# Altium schematic sheet protecao.SchDoc
size A4
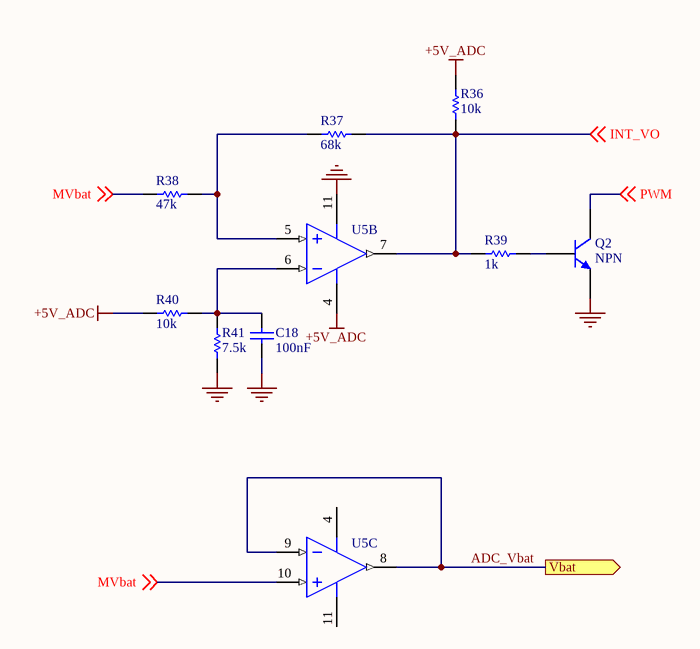
[diagram p0: protecao.SchDoc]

## Parts
C18  100nF  [6-0805_M]
Q2  NPN  [TO-226-AA]
R36  10k  [6-0805_M]
R37  68k  [6-0805_M]
R38  47k  [6-0805_M]
R39  1k  [6-0805_M]
R40  10k  [6-0805_M]
R41  7.5k  [6-0805_M]
U5  LP324M  [M14A_M]  (value not drawn)  (parts B,C of 4)

## Ports
Vbat (out)

## Nets
+5V_ADC: R36.1 R40.1 U5.4(V+)
GND: C18.1 Q2.3(E) R41.1 U5.11(GND)
ADC_Vbat: U5.8(OUT3) U5.9(IN3-) ; port Vbat
INT_VO: R36.2 R37.2 R39.1 U5.7(OUT2) ; off-sheet INT_VO
MVbat: R38.1 U5.10(IN3+) ; off-sheet MVbat
PWM: Q2.1(C) ; off-sheet PWM
NetC18_2: C18.2 R40.2 R41.2 U5.6(IN2-)
NetQ2_2: Q2.2(B) R39.2
NetR37_1: R37.1 R38.2 U5.5(IN2+)

## Library data of the parts
C18 = Cap_3: Capacitor; Published: 8-Jun-2000; LatestRevisionDate: 17-Jul-2002; LatestRevisionNote: Re-released for DXP Platform.; PackageReference: RAD-0.3; Publisher: Altium Limited; PackageDescription: Radial Cap, Thru-Hole; 2 Leads; 0.3 in Pin Spacing; Value: 100nF
Q2 = NPN: NPN Bipolar Transistor; Published: 8-Jun-2000; LatestRevisionDate: 17-Jul-2002; LatestRevisionNote: Re-released for DXP Platform.; PackageReference: TO-226-AA; Publisher: Altium Limited; PackageDescription: TO, Flat Index; 3 In-Line, Axial Leads; Body Dia. 4.8mm; Leads 0.55 x 0.51 mm (max); Code_JEDEC: TO-226-AA
R36-R41 = Res1: Resistor; Published: 8-Jun-2000; LatestRevisionDate: 17-Jul-2002; LatestRevisionNote: Re-released for DXP Platform.; PackageReference: AXIAL-0.3; Publisher: Altium Limited; PackageDescription: Axial Device, Thru-Hole; 2 Leads; 0.3 in Pin Spacing
  R36 R40: Value: 10k
  R37: Value: 68k
  R38: Value: 47k
  R39: Value: 1k
  R41: Value: 7.5k
U5 = LP324M: Micropower Quad Operational Amplifier; Manufacturer: National Semiconductor; CompType: Amplifiers; PackageTopMarking: NSUZXYTT*LP324M; PowerWise: N; Published: 4-Dec-2008; DatasheetVersion: Jul-2001; PackageVersion: revJ, Jan-1996; PackageReference: M14A; Publisher: Altium Limited; PackageDescription: Molded Package S.O., .150in Wide, 14 Lead; PartNumber: LP324M; RoHS: O; PinCount: 14; DigiKeyPartNumber: LP324MXCT-ND; Code_JEDEC: MS-012AB; Code_IPC: SOIC127P600-14; ComponentLink1Description: LP324 Datasheet; ComponentLink1URL: http://www.national.com/ds/LP/LP324.pdf; ComponentLink2Description: LP324 Web Page; ComponentLink2URL: http://www.national.com/pf/LP/LP324.html; ComponentLink3Description: M14A Package Page; ComponentLink3URL: http://www.national.com/packaging/folders/m14a.html